# Altium project I2C_Jog_Controller.PrjPCB
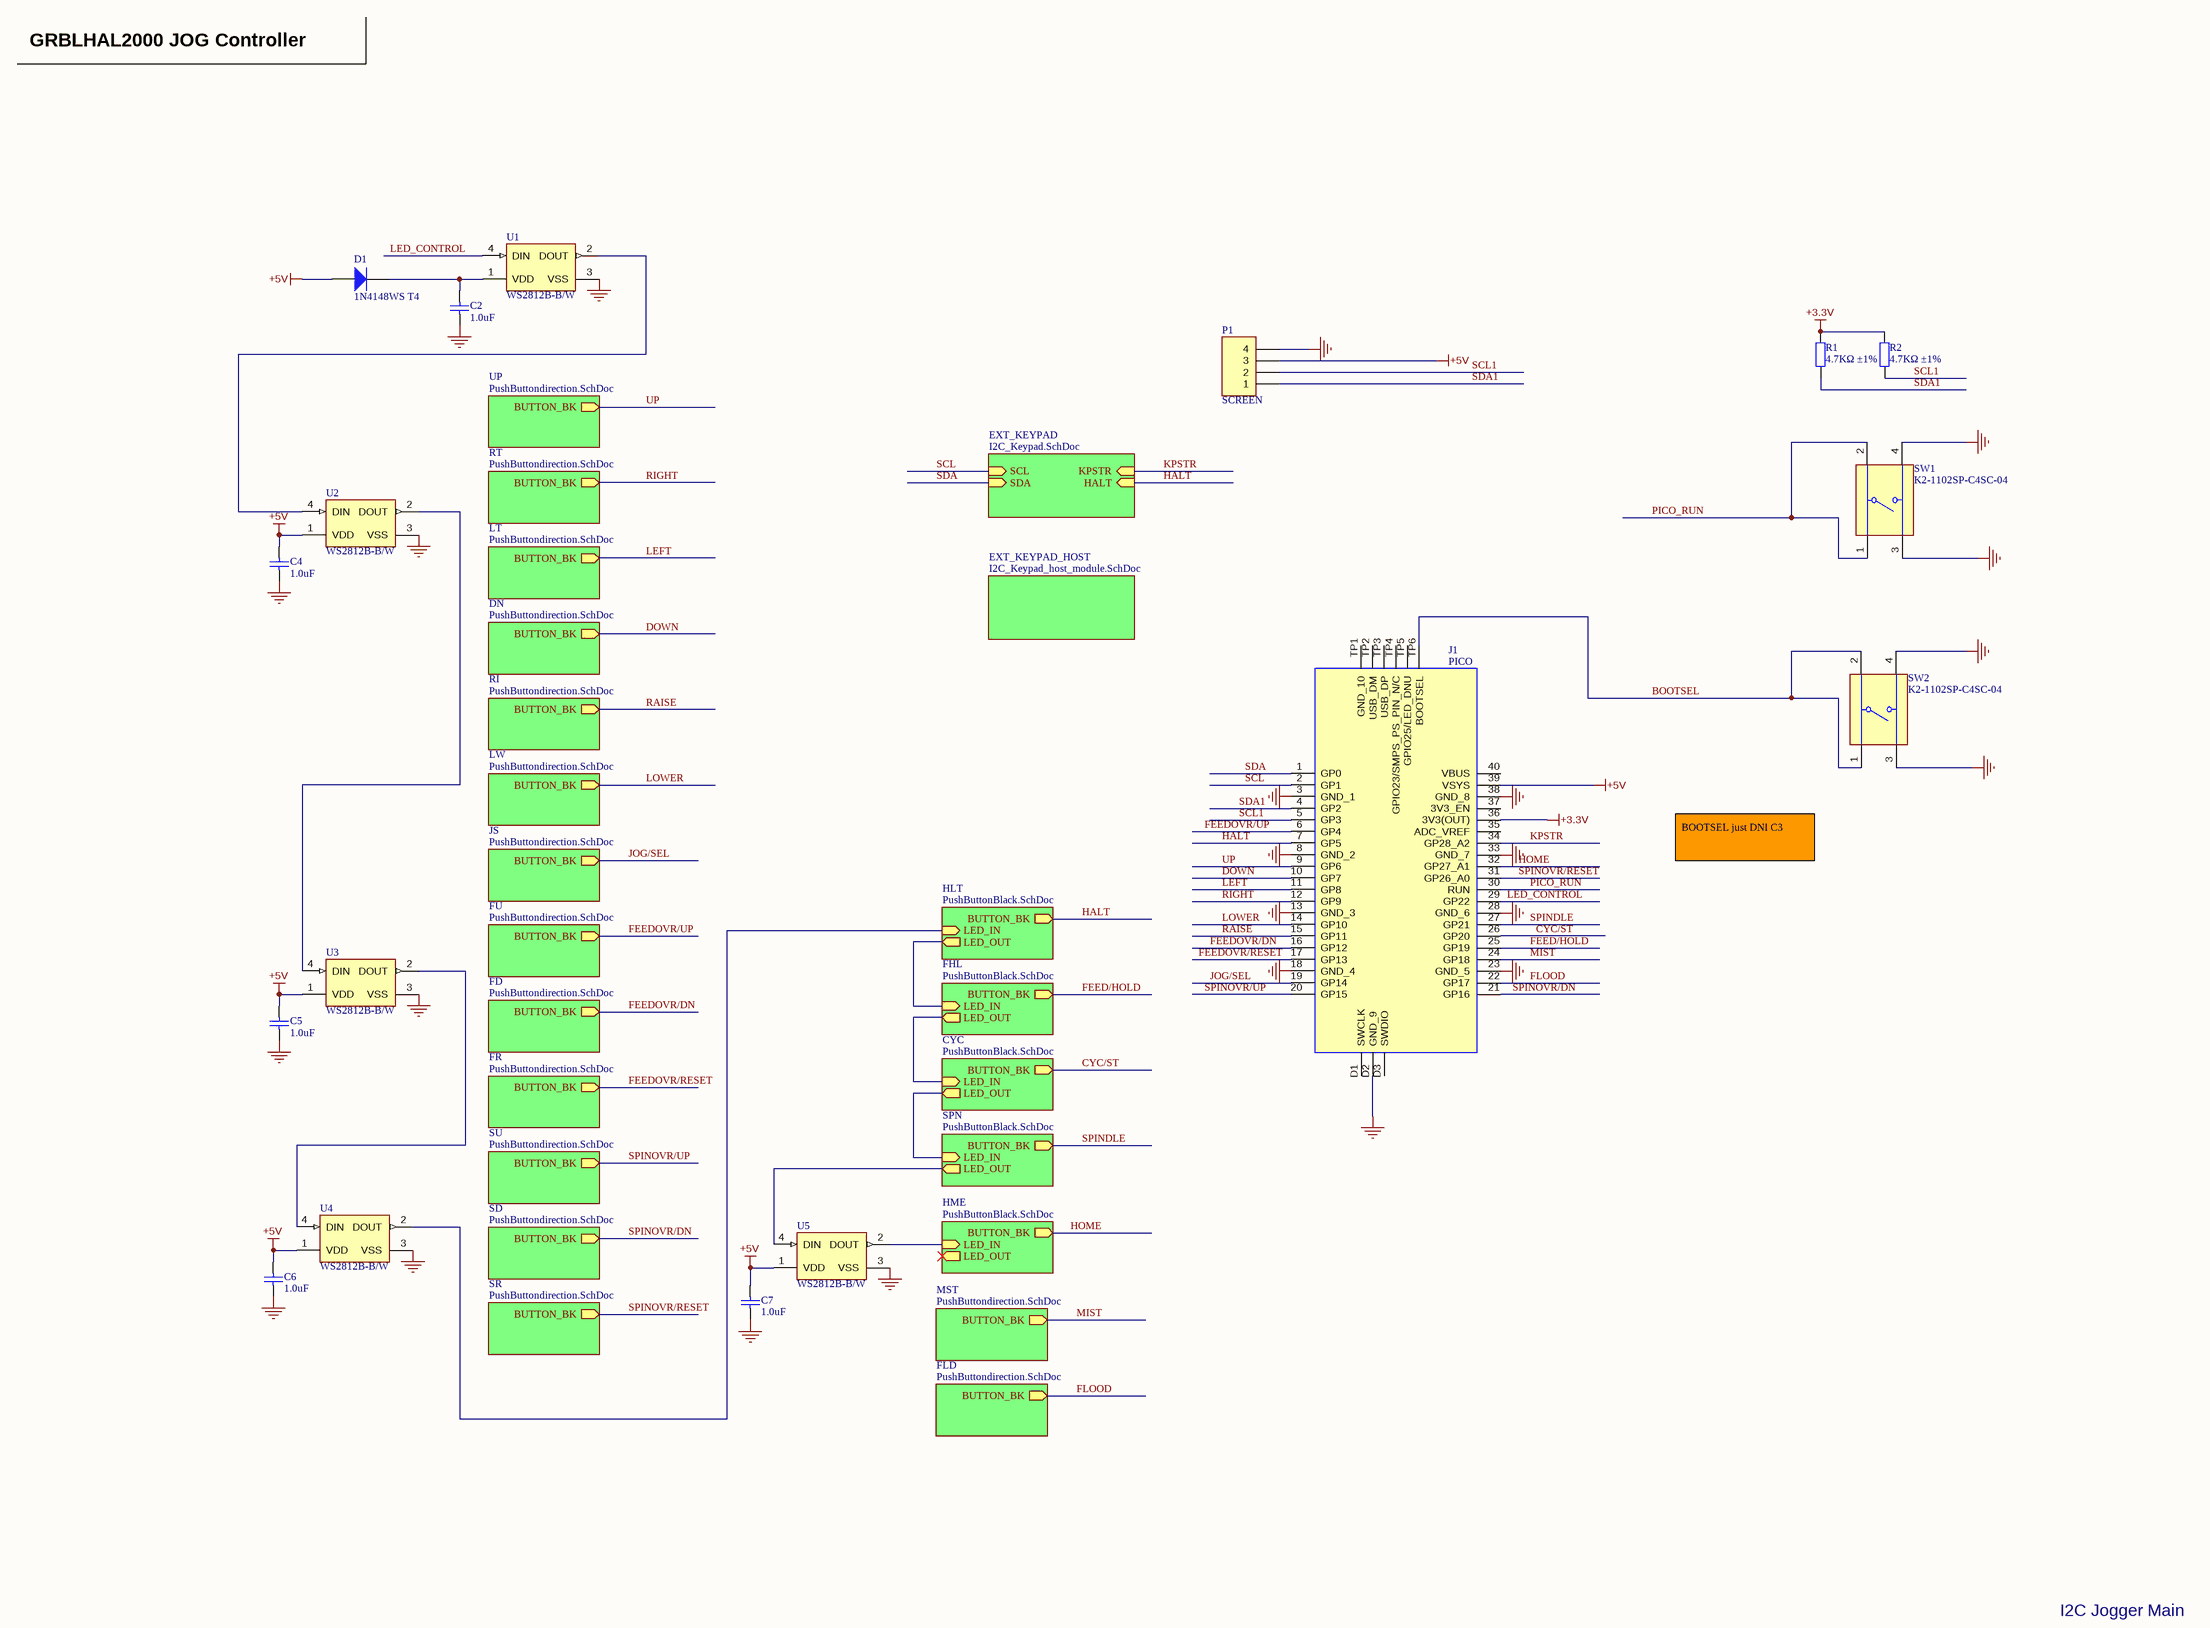
[diagram p0: I2C_Jog_Controller.SchDoc]
VarRevNo: A5; Title: JOG_CONTROLLER; PCBREVNO: A5; PCBPARTNO: JOG_CONTROLLER
3 sheets, 42 parts. Net scope: hierarchical (ports join the sheet entries above them; power ports are global).
Board file: I2C_Jog_Controller.pcbdoc
Sheets:
  I2C_Jog_Controller.SchDoc
    EXT_KEYPAD = I2C_Keypad.SchDoc
    EXT_KEYPAD_HOST = I2C_Keypad_host_module.SchDoc

## Sheet I2C_Jog_Controller.SchDoc: Bluebell MFG PCB
size C; Author: AM; CompanyName: Cambridge Mobile Telematics; DrawnBy: A.Marles; Engineer: DM; Organization: Silver Bullet Technology; Address1: Schematic; Address2: 101 Main Street, 14th Floor; Address3: Cambridge, MA 02142; Address4: USA; DocumentNumber: 3; Revision: A5; SheetNumber: 3; SheetTotal: 6

### Parts
C2  1.0uF  [0402_C]
C4  1.0uF  [0402_C]
C5  1.0uF  [0402_C]
C6  1.0uF  [0402_C]
C7  1.0uF  [0402_C]
D1  1N4148WS T4  [SOD-323]
J1  PICO  [PICO]  (no BOM)
P1  SCREEN  [HDR1X4]  (no BOM)
R1  4.7KΩ ±1%  [0402_R]
R2  4.7KΩ ±1%  [0402_R]
SW1  K2-1102SP-C4SC-04  [TECO-FSM4JSMATR_V]
SW2  K2-1102SP-C4SC-04  [TECO-FSM4JSMATR_V]
U1  WS2812B-B/W  [ADA-RGB-1655_V]
U2  WS2812B-B/W  [ADA-RGB-1655_V]
U3  WS2812B-B/W  [ADA-RGB-1655_V]
U4  WS2812B-B/W  [ADA-RGB-1655_V]
U5  WS2812B-B/W  [ADA-RGB-1655_V]

### Sub-sheets
CYC = PushButtonBlack.SchDoc (file not in this document): BUTTON_BK (out), LED_IN (in), LED_OUT (out)
DN = PushButtondirection.SchDoc (file not in this document): BUTTON_BK (out)
EXT_KEYPAD = I2C_Keypad.SchDoc: SCL (in), SDA (in), KPSTR (in), HALT (in)
EXT_KEYPAD_HOST = I2C_Keypad_host_module.SchDoc: no entries
FD = PushButtondirection.SchDoc (file not in this document): BUTTON_BK (out)
FHL = PushButtonBlack.SchDoc (file not in this document): BUTTON_BK (out), LED_IN (in), LED_OUT (out)
FLD = PushButtondirection.SchDoc (file not in this document): BUTTON_BK (out)
FR = PushButtondirection.SchDoc (file not in this document): BUTTON_BK (out)
FU = PushButtondirection.SchDoc (file not in this document): BUTTON_BK (out)
HLT = PushButtonBlack.SchDoc (file not in this document): BUTTON_BK (out), LED_IN (in), LED_OUT (out)
HME = PushButtonBlack.SchDoc (file not in this document): BUTTON_BK (out), LED_IN (in), LED_OUT (out)
JS = PushButtondirection.SchDoc (file not in this document): BUTTON_BK (out)
LT = PushButtondirection.SchDoc (file not in this document): BUTTON_BK (out)
LW = PushButtondirection.SchDoc (file not in this document): BUTTON_BK (out)
MST = PushButtondirection.SchDoc (file not in this document): BUTTON_BK (out)
RI = PushButtondirection.SchDoc (file not in this document): BUTTON_BK (out)
RT = PushButtondirection.SchDoc (file not in this document): BUTTON_BK (out)
SD = PushButtondirection.SchDoc (file not in this document): BUTTON_BK (out)
SPN = PushButtonBlack.SchDoc (file not in this document): BUTTON_BK (out), LED_IN (in), LED_OUT (out)
SR = PushButtondirection.SchDoc (file not in this document): BUTTON_BK (out)
SU = PushButtondirection.SchDoc (file not in this document): BUTTON_BK (out)
UP = PushButtondirection.SchDoc (file not in this document): BUTTON_BK (out)

### Nets
+3.3V: J1.36(3V3(OUT)) R1.2 R2.2
+5V: C4.2 C5.2 C6.2 C7.2 D1.1(A) J1.39(VSYS) P1.3 U2.1(VDD) U3.1(VDD) U4.1(VDD) U5.1(VDD)
GND: C2.1 C4.1 C5.1 C6.1 C7.1 J1.3(GND_1) J1.8(GND_2) J1.13(GND_3) J1.18(GND_4) J1.23(GND_5) J1.28(GND_6) J1.33(GND_7) J1.38(GND_8) J1.D2(GND_9) P1.4 SW1.3 SW1.4 SW2.3 SW2.4 U1.3(VSS) U2.3(VSS) U3.3(VSS) U4.3(VSS) U5.3(VSS)
BOOTSEL: J1.TP6(BOOTSEL) SW2.1 SW2.2
CYC/ST: J1.26(GP20) ; sheet CYC/BUTTON_BK
DOWN: J1.10(GP7) ; sheet DN/BUTTON_BK
FEED/HOLD: J1.25(GP19) ; sheet FHL/BUTTON_BK
FEEDOVR/DN: J1.16(GP12) ; sheet FD/BUTTON_BK
FEEDOVR/RESET: J1.17(GP13) ; sheet FR/BUTTON_BK
FEEDOVR/UP: J1.6(GP4) ; sheet FU/BUTTON_BK
FLOOD: J1.22(GP17) ; sheet FLD/BUTTON_BK
HALT: J1.7(GP5) ; sheet EXT_KEYPAD/HALT, sheet HLT/BUTTON_BK
HOME: J1.32(GP27_A1) ; sheet HME/BUTTON_BK
JOG/SEL: J1.19(GP14) ; sheet JS/BUTTON_BK
KPSTR: J1.34(GP28_A2) ; sheet EXT_KEYPAD/KPSTR
LED_CONTROL: J1.29(GP22) U1.4(DIN)
LEFT: J1.11(GP8) ; sheet LT/BUTTON_BK
LOWER: J1.14(GP10) ; sheet LW/BUTTON_BK
MIST: J1.24(GP18) ; sheet MST/BUTTON_BK
PICO_RUN: J1.30(RUN) SW1.1 SW1.2
RAISE: J1.15(GP11) ; sheet RI/BUTTON_BK
RIGHT: J1.12(GP9) ; sheet RT/BUTTON_BK
SCL: J1.2(GP1) ; sheet EXT_KEYPAD/SCL
SCL1: J1.5(GP3) P1.2 R2.1
SDA: J1.1(GP0) ; sheet EXT_KEYPAD/SDA
SDA1: J1.4(GP2) P1.1 R1.1
SPINDLE: J1.27(GP21) ; sheet SPN/BUTTON_BK
SPINOVR/DN: J1.21(GP16) ; sheet SD/BUTTON_BK
SPINOVR/RESET: J1.31(GP26_A0) ; sheet SR/BUTTON_BK
SPINOVR/UP: J1.20(GP15) ; sheet SU/BUTTON_BK
UP: J1.9(GP6) ; sheet UP/BUTTON_BK
NetC2_2: C2.2 D1.2(K) U1.1(VDD)
NetU1_2: U1.2(DOUT) U2.4(DIN)
NetU2_2: U2.2(DOUT) U3.4(DIN)
NetU3_2: U3.2(DOUT) U4.4(DIN)
NetU4_2: U4.2(DOUT) ; sheet HLT/LED_IN
NetU5_2: U5.2(DOUT) ; sheet HME/LED_IN
NetU5_4: U5.4(DIN) ; sheet SPN/LED_OUT
(unnamed): sheet SPN/LED_IN, sheet CYC/LED_OUT
(unnamed): sheet CYC/LED_IN, sheet FHL/LED_OUT
(unnamed): sheet FHL/LED_IN, sheet HLT/LED_OUT

Not connected (* = marked no-connect by the designer): J1 35(ADC_VREF) 37(3V3_EN) 40(VBUS) D1(SWCLK) D3(SWDIO) TP1(GND_10) TP2(USB_DM) TP3(USB_DP) TP4(GPIO23/SMPS_PS_PIN_N/C) TP5(GPIO25/LED_DNU)

### Notes on the sheet
- GRBLHAL2000 JOG Controller
- BOOTSEL just DNI C3
- I2C Jogger Main
- Expatria Technologies
- SHEET
- PROJECT
- REV
- 1136 Glade Court
- Port Coquitlam, BC V3B 1R5
- EMAIL: INFO@EXPATRIA.CA
- SIZE
- ENGR
- C
- MODIFIED
- DOCUMENT
- /
- Copyright Expatria Technologies 2021.  This document describes Open Hardware and is licensed under the CERN-OHL-P  v2.  No warranty is implied or expressed.

### Library data of the parts
C2 C4-C7 = 0402 1.0uF (105) 10% 25V: Chip capacitor; Manufacturer: Samsung Electro-Mechanics; PartNumber: CL05A105KA5NQNC; Capacitance: 1uF; Tolerance: 10%; Voltage: 25V; ComponentLink1Description: Supplier link; ComponentLink1URL: http://www.szlcsc.com/product/details_53938.html; Package: 0402; Supplier: LC; SuppliersPartNumber: C52923
D1 = SOD-323 1N4148WS T4: 二极管; ComponentLink1Description: 供应商链接; ComponentLink1URL: http://www.szlcsc.com/product/details_2485.html; Package: SOD-323; Supplier: LC; SuppliersPartNumber: C2128
J1 = PICO: Connector; Manufacturer_Name: RASPBERRY-PI; Datasheet Link: https://datasheets.raspberrypi.org/pico/pico_datasheet.pdf; Height: 1mm; Manufacturer_Part_Number: PICO
P1 = Header 4: Header, 4-Pin; LatestRevisionDate: 17-Jul-2002; LatestRevisionNote: Re-released for DXP Platform.; Publisher: Altium Limited
R1 R2 = 0402 4.7K (4701) 1%: Chip resistor; Manufacturer: Uniroyal Elec; PartNumber: 0402WGF4701TCE; Power: 1/16W; ComponentLink1Description: Supplier link; ComponentLink1URL: http://www.szlcsc.com/product/details_26643.html; Package: 0402; Supplier: LC; SuppliersPartNumber: C25900; Resistance: 4.7KΩ; Tolerance: 1%
SW1 SW2 = CMP-2000-07486-1: Top Actuated 50mA @ 12VDC Round Button SPST 6*6mm Tactile Switches ROHS; SuppliersPartNumber: C127509; Package: SMD-4_6.0x6.0x4.5P
U1-U5 = CMP-2000-05026-1: Intelligent Control LED Integrated Light Source, 3.5 to 5.3 V, -25 to 80 degC, 4-Pin SMD, RoHS, Tape and Reel; Manufacturer: Worldsemi; Package Description: 4-Pin Surface Mount Device, Body 5 x 5 mm; SuppliersPartNumber: C2761795; Part_Number: WS2812B-B/W

## Sheet I2C_Keypad.SchDoc: JOG_CONTROLLER
size B; DocumentNumber: 4; SheetNumber: 4; SheetTotal: 6
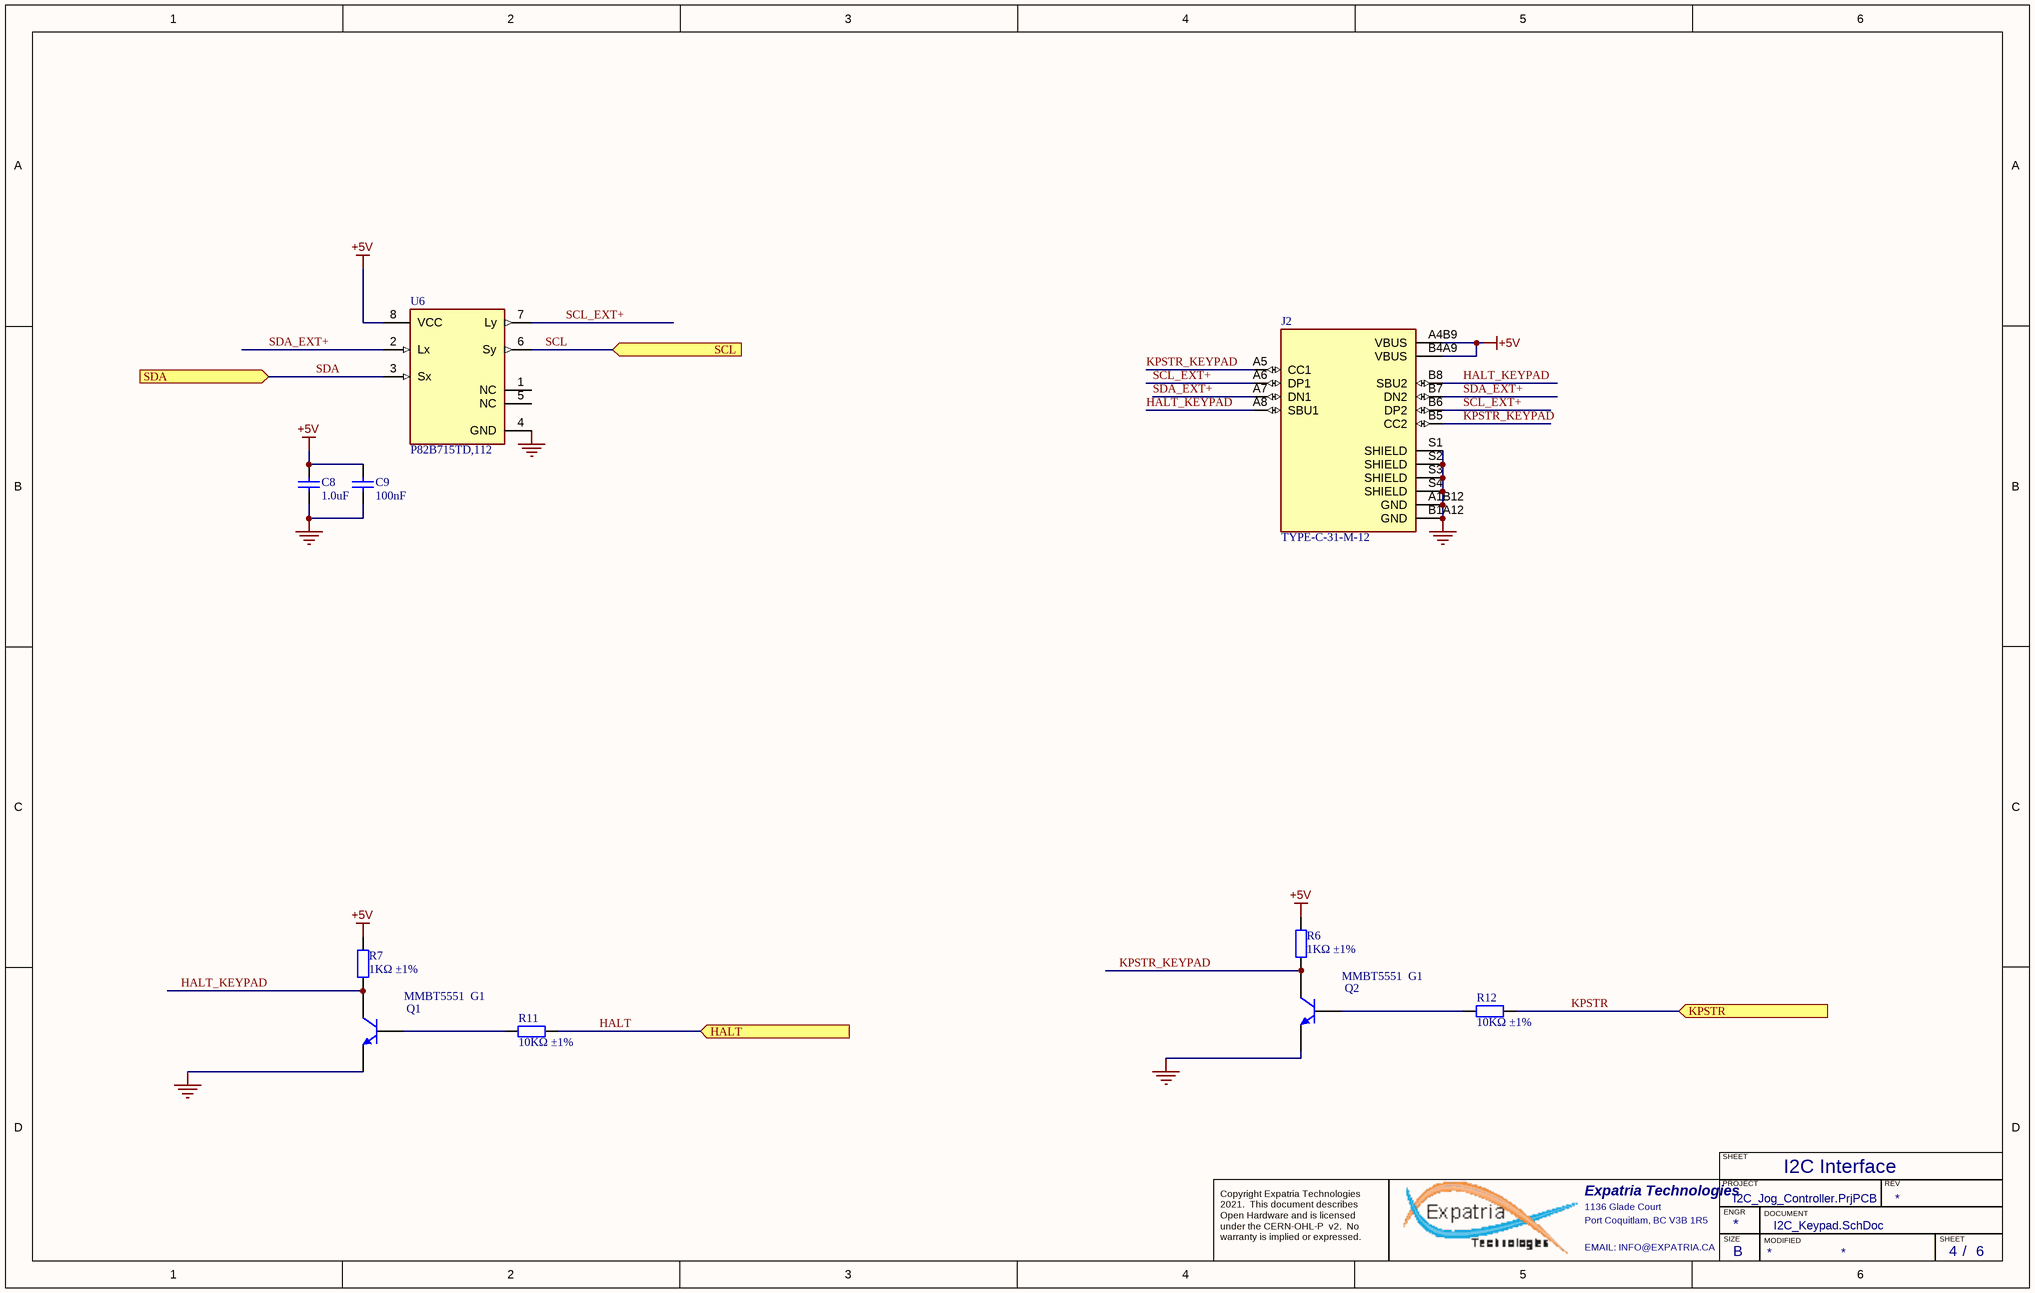
[diagram p1: I2C_Keypad.SchDoc]

### Parts
C8  1.0uF  [0402_C]
C9  100nF  [0402_C]
J2  TYPE-C-31-M-12  [HRO_TYPE-C-31-M-12]
Q1  MMBT5551  G1  [SOT-23(SOT-23-3)]
Q2  MMBT5551  G1  [SOT-23(SOT-23-3)]
R6  1KΩ ±1%  [0402_R]
R7  1KΩ ±1%  [0402_R]
R11  10KΩ ±1%  [0402_R]
R12  10KΩ ±1%  [0402_R]
U6  P82B715TD,112  [FP-SOT96-1-MFG]

### Ports
HALT (in), KPSTR (in), SCL (in), SDA (in)

### Nets
+5V: C8.2 C9.2 J2.A4B9(VBUS) J2.B4A9(VBUS) R6.1 R7.1 U6.8(VCC)
GND: C8.1 C9.1 J2.A1B12(GND) J2.B1A12(GND) J2.S1(SHIELD) J2.S2(SHIELD) J2.S3(SHIELD) J2.S4(SHIELD) Q1.2(E) Q2.2(E) U6.4(GND)
HALT: R11.2 ; port HALT
HALT_KEYPAD: J2.A8(SBU1) J2.B8(SBU2) Q1.3(C) R7.2
KPSTR: R12.1 ; port KPSTR
KPSTR_KEYPAD: J2.A5(CC1) J2.B5(CC2) Q2.3(C) R6.2
SCL: U6.6(Sy) ; port SCL
SCL_EXT+: J2.A6(DP1) J2.B6(DP2) U6.7(Ly)
SDA: U6.3(Sx) ; port SDA
SDA_EXT+: J2.A7(DN1) J2.B7(DN2) U6.2(Lx)
NetQ1_1: Q1.1(B) R11.1
NetQ2_1: Q2.1(B) R12.2

Not connected (* = marked no-connect by the designer): U6 1(NC) 5(NC)

### Notes on the sheet
- I2C Interface
- SHEET
- Expatria Technologies
- 1136 Glade Court
- Port Coquitlam, BC V3B 1R5
- PROJECT
- SIZE
- ENGR
- MODIFIED
- DOCUMENT
- REV
- Copyright Expatria Technologies 2021.  This document describes Open Hardware and is licensed under the CERN-OHL-P  v2.  No warranty is implied or expressed.
- EMAIL: INFO@EXPATRIA.CA
- B
- /

### Library data of the parts
C8 = 0402 1.0uF (105) 10% 25V: as C2 on sheet I2C_Jog_Controller; ComponentLink1Description: Supplier link; ComponentLink1URL: http://www.szlcsc.com/product/details_53938.html; Package: 0402; Supplier: LC; SuppliersPartNumber: C52923
C9 = 0402 100nF (104) 10% 16V: Chip capacitors; Manufacturer: Samsung Electro-Mechanics; PartNumber: CL05B104KO5NNNC; Tolerance: 10%; Voltage: 16V; ComponentLink1Description: Supplier link; ComponentLink1URL: http://www.szlcsc.com/product/details_1877.html; Package: 0402; Supplier: LC; SuppliersPartNumber: C1525; Capacitance: 100nF
J2 = TYPE-C-31-M-12: USB Connectors 24 Receptacle 1 8.94*7.3mm RoHS; MF: HRO Electronics Co., Ltd.; Value: *; SnapEDA_Link: https://www.snapeda.com/parts/TYPE-C-31-M-12/HRO%20Electronics%20Co.,%20Ltd./view-part/3228496/?ref=snap; Package: Package; MP: TYPE-C-31-M-12; Price: None; Availability: Unavailable; SuppliersPartNumber: C2765186
Q1 Q2 = SOT-23 MMBT5551  G1: 三极管; ComponentLink1Description: 供应商链接; ComponentLink1URL: http://www.szlcsc.com/product/details_2502.html; Package: SOT-23; Supplier: LC; SuppliersPartNumber: C2145
R6 R7 = 0402 1K (1001) 1%: Chip resistor; Manufacturer: Uniroyal Elec; PartNumber: 0402WGF1001TCE; Power: 1/16W; ComponentLink1Description: Supplier link; ComponentLink1URL: http://www.szlcsc.com/product/details_12256.html; Package: 0402; Supplier: LC; SuppliersPartNumber: C11702; Resistance: 1KΩ; Tolerance: 1%
R11 R12 = 0402 10K (1002) 1%: Chip resistor; Manufacturer: Uniroyal Elec; PartNumber: 0402WGF1002TCE; Power: 1/16W; ComponentLink1Description: Supplier link; ComponentLink1URL: http://www.szlcsc.com/product/details_26487.html; Package: 0402; Supplier: LC; SuppliersPartNumber: C25744; Resistance: 10KΩ; Tolerance: 1%
U6 = CMP-10107-000005-1: IC REDRIVER I2C 1CH 400KHZ 8SO; Manufacturer: NXP Semicon; Manufacturer_Part_Number: P82B715TD,118; Package: SO-8; SuppliersPartNumber: C2649394

## Sheet I2C_Keypad_host_module.SchDoc: JOG_CONTROLLER
size B; Author: AM; CompanyName: Expatria Technologies; DrawnBy: A.Marles; Engineer: AM; Organization: Expatria Technologies; DocumentNumber: 13; Revision: A1; SheetNumber: 13; SheetTotal: 14; PCB_Rev: A1
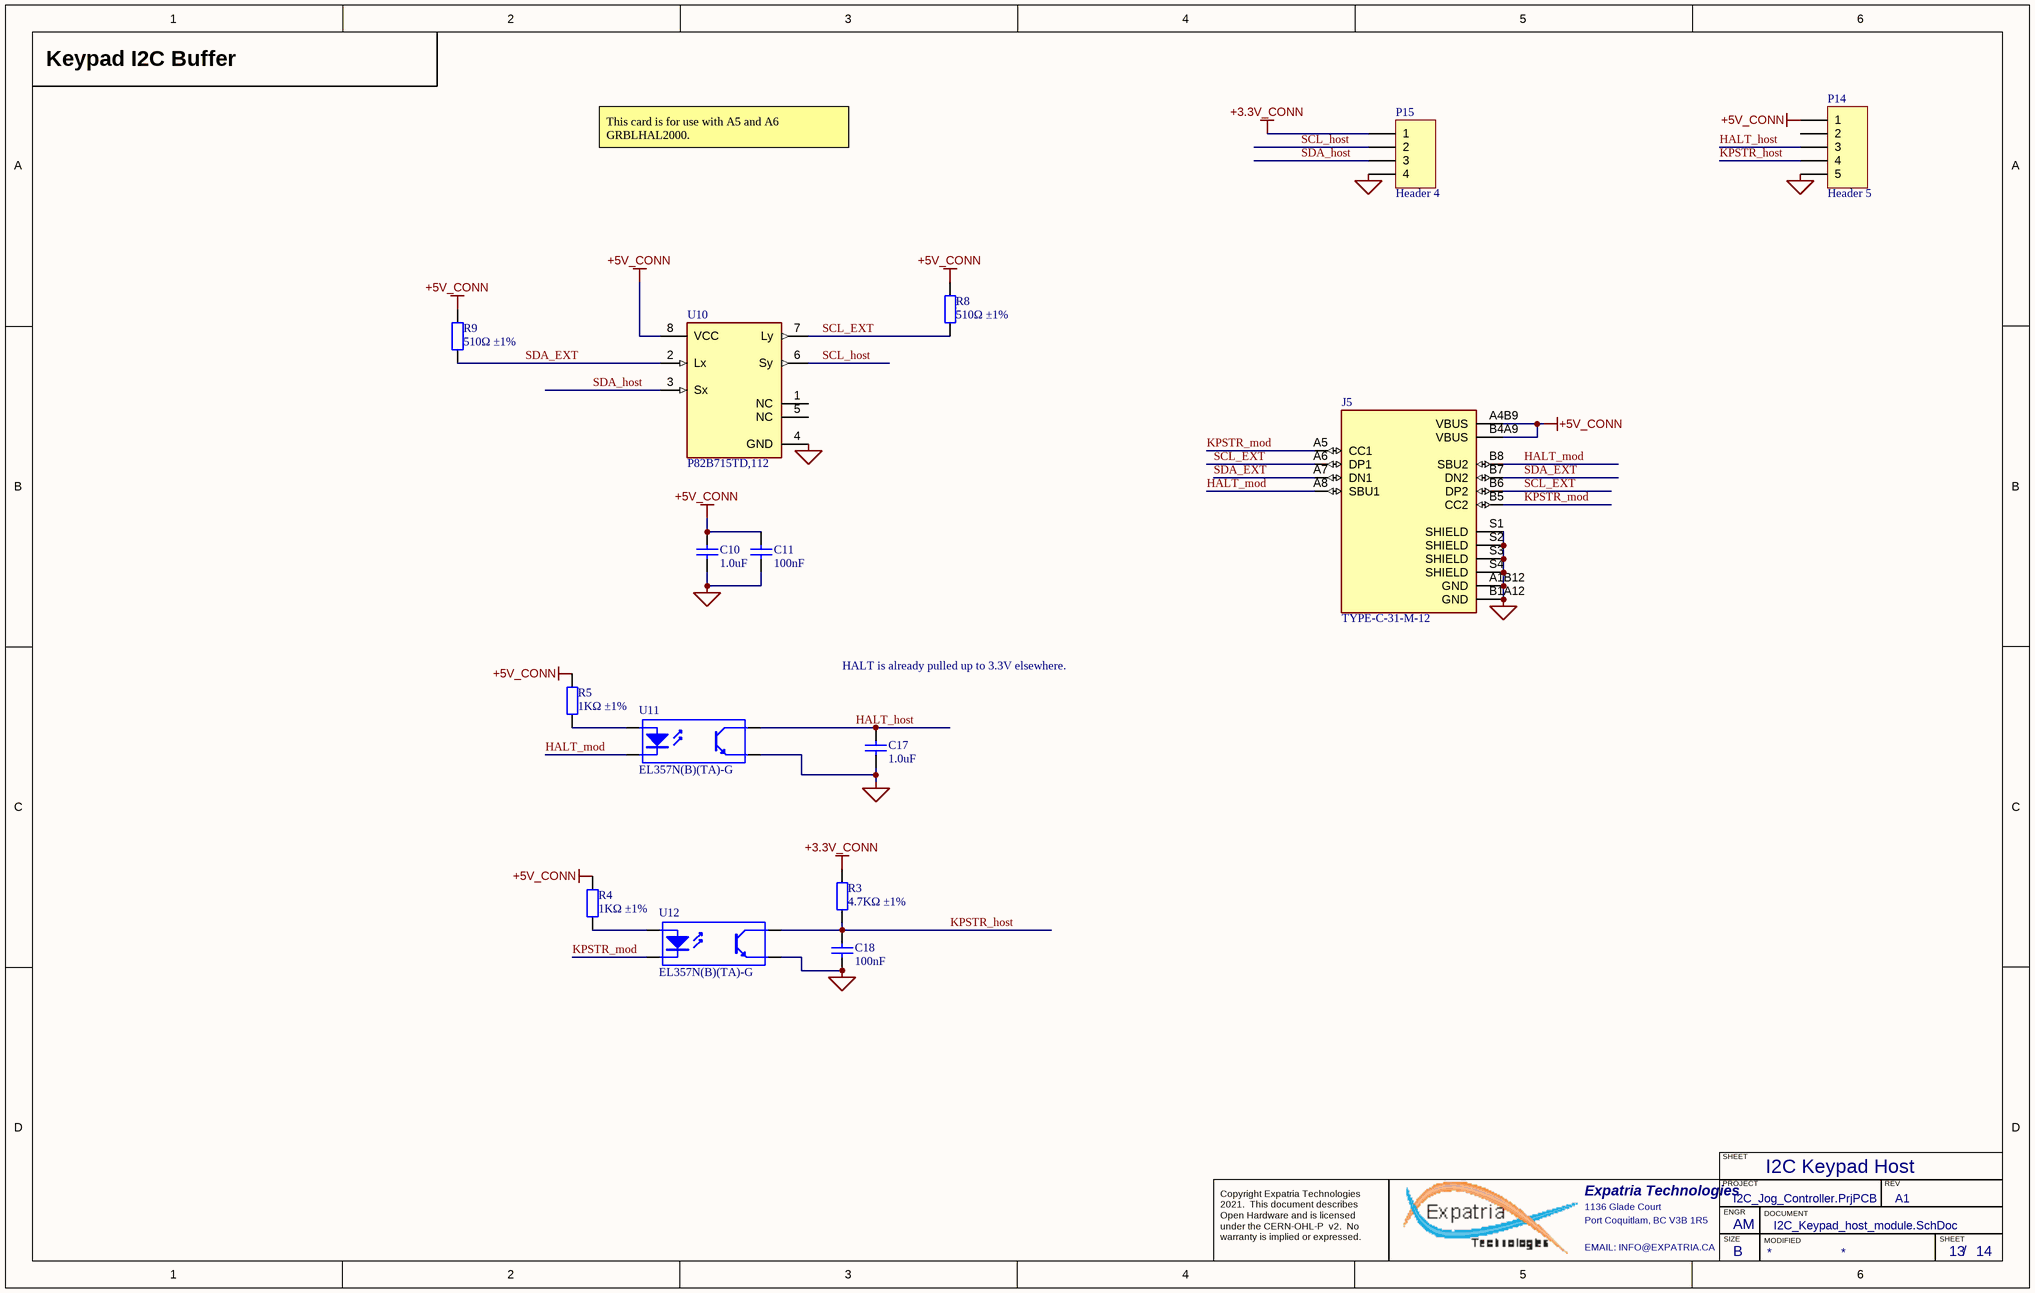
[diagram p2: I2C_Keypad_host_module.SchDoc]

### Parts
C10  1.0uF  [0402_C]
C11  100nF  [0402_C]
C17  1.0uF  [0402_C]
C18  100nF  [0402_C]
J5  TYPE-C-31-M-12  [HRO_TYPE-C-31-M-12]
P14  Header 5  [HDR1X5]  (no BOM)
P15  Header 4  [HDR1X4]  (no BOM)
R3  4.7KΩ ±1%  [0402_R]
R4  1KΩ ±1%  [0402_R]
R5  1KΩ ±1%  [0402_R]
R8  510Ω ±1%  [0402_R]
R9  510Ω ±1%  [0402_R]
U10  P82B715TD,112  [FP-SOT96-1-MFG]
U11  EL357N(B)(TA)-G  [SOP-4_P2.54]
U12  EL357N(B)(TA)-G  [SOP-4_P2.54]

### Nets
+3.3V_CONN: P15.1 R3.2
+5V_CONN: C10.2 C11.2 J5.A4B9(VBUS) J5.B4A9(VBUS) P14.1 R4.1 R5.1 R8.2 R9.2 U10.8(VCC)
GND_CONN: C10.1 C11.1 C17.1 C18.1 J5.A1B12(GND) J5.B1A12(GND) J5.S1(SHIELD) J5.S2(SHIELD) J5.S3(SHIELD) J5.S4(SHIELD) P14.5 P15.4 U10.4(GND) U11.3(E) U12.3(E)
HALT_host: C17.2 P14.3 U11.4(C)
HALT_mod: J5.A8(SBU1) J5.B8(SBU2) U11.2(K)
KPSTR_host: C18.2 P14.4 R3.1 U12.4(C)
KPSTR_mod: J5.A5(CC1) J5.B5(CC2) U12.2(K)
SCL_EXT: J5.A6(DP1) J5.B6(DP2) R8.1 U10.7(Ly)
SCL_host: P15.2 U10.6(Sy)
SDA_EXT: J5.A7(DN1) J5.B7(DN2) R9.1 U10.2(Lx)
SDA_host: P15.3 U10.3(Sx)
NetR4_2: R4.2 U12.1(A)
NetR5_2: R5.2 U11.1(A)

Not connected (* = marked no-connect by the designer): P14 2; U10 1(NC) 5(NC)

### Notes on the sheet
- Keypad I2C Buffer
- This card is for use with A5 and A6 GRBLHAL2000.
- HALT is already pulled up to 3.3V elsewhere.
- I2C Keypad Host
- SHEET
- Expatria Technologies
- 1136 Glade Court
- Port Coquitlam, BC V3B 1R5
- PROJECT
- SIZE
- ENGR
- MODIFIED
- DOCUMENT
- REV
- Copyright Expatria Technologies 2021.  This document describes Open Hardware and is licensed under the CERN-OHL-P  v2.  No warranty is implied or expressed.
- EMAIL: INFO@EXPATRIA.CA
- B
- /

### Library data of the parts
C10 C17 = 0402 1.0uF (105) 10% 25V: as C2 on sheet I2C_Jog_Controller; ComponentLink1Description: Supplier link; ComponentLink1URL: http://www.szlcsc.com/product/details_53938.html; Package: 0402; Supplier: LC; SuppliersPartNumber: C52923
C11 C18 = 0402 100nF (104) 10% 16V: as C9 on sheet I2C_Keypad; ComponentLink1Description: Supplier link; ComponentLink1URL: http://www.szlcsc.com/product/details_1877.html; Package: 0402; Supplier: LC; SuppliersPartNumber: C1525; Capacitance: 100nF
J5 = TYPE-C-31-M-12: as J2 on sheet I2C_Keypad; Value: *; SnapEDA_Link: https://www.snapeda.com/parts/TYPE-C-31-M-12/HRO%20Electronics%20Co.,%20Ltd./view-part/3228496/?ref=snap; Package: Package; MP: TYPE-C-31-M-12; Price: None; Availability: Unavailable; SuppliersPartNumber: C2765186
P14 = Header 5: Header, 5-Pin; LatestRevisionDate: 17-Jul-2002; LatestRevisionNote: Re-released for DXP Platform.; Publisher: Altium Limited; SuppliersPartNumber: C124379
P15 = Header 4: Header, 4-Pin; Publisher: Altium Limited; SuppliersPartNumber: C124378
R3 = 0402 4.7K (4701) 1%: as R1 on sheet I2C_Jog_Controller; ComponentLink1Description: Supplier link; ComponentLink1URL: http://www.szlcsc.com/product/details_26643.html; Package: 0402; Supplier: LC; SuppliersPartNumber: C25900; Resistance: 4.7KΩ; Tolerance: 1%
R4 R5 = 0402 1K (1001) 1%: as R6 on sheet I2C_Keypad; ComponentLink1Description: Supplier link; ComponentLink1URL: http://www.szlcsc.com/product/details_12256.html; Package: 0402; Supplier: LC; SuppliersPartNumber: C11702; Resistance: 1KΩ; Tolerance: 1%
R8 R9 = 0402 510R (5100) 1%: Chip resistor; Manufacturer: Uniroyal Elec; PartNumber: 0402WGF5100TCE; Power: 1/16W; ComponentLink1Description: Supplier link; ComponentLink1URL: http://www.szlcsc.com/product/details_25866.html; Package: 0402; Supplier: LC; SuppliersPartNumber: C25123; Resistance: 510Ω; Tolerance: 1%
U10 = CMP-10107-000005-1: as U6 on sheet I2C_Keypad; Package: SO-8; SuppliersPartNumber: C2649394
U11 U12 = EL357N(B)(TA)-G_[C6649]: 贴片光耦; ComponentLink1Description: 供应商链接; ComponentLink1URL: http://www.szlcsc.com/product/details_7114.html; Package: SOP-4_P2.54; Supplier: LC; SuppliersPartNumber: C6649

## Nets that join several sheets
+5V: I2C_Jog_Controller (11 pins), I2C_Keypad (7 pins)
GND: I2C_Jog_Controller (24 pins), I2C_Keypad (11 pins)
HALT: I2C_Jog_Controller (J1.7), I2C_Keypad (R11.2)
KPSTR: I2C_Jog_Controller (J1.34), I2C_Keypad (R12.1)
SCL: I2C_Jog_Controller (J1.2), I2C_Keypad (U6.6)
SDA: I2C_Jog_Controller (J1.1), I2C_Keypad (U6.3)

## Assembly variants
FULL_ASSEMBLY: not fitted J1 P1 Q2 U2 U3 U4